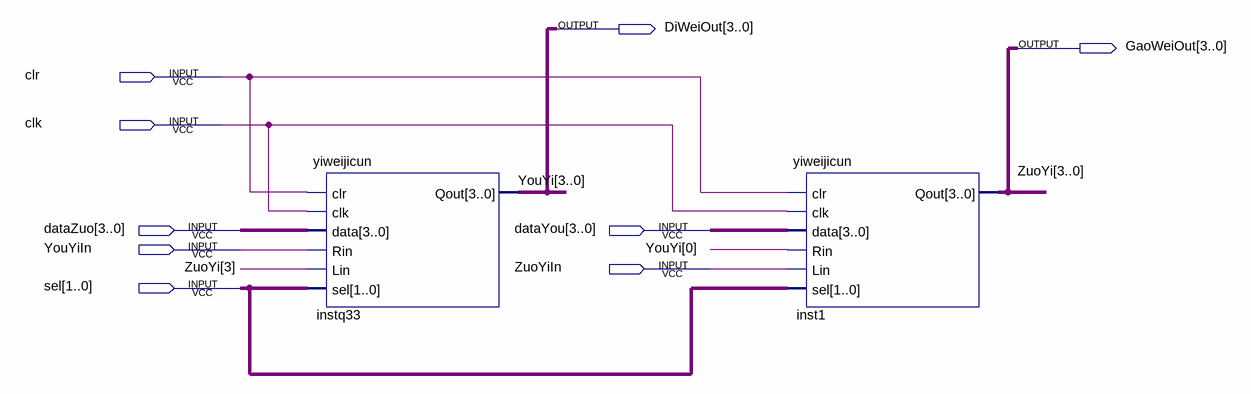
[diagram p0: schematic sheet]
// Quartus schematic g04_190711_08.bdf as structural Verilog: 2 symbols, 9 pins
module g04_190711_08 (
  input  clr,
  input  clk,
  input  [3:0] dataZuo,
  input  [3:0] dataYou,
  input  YouYiIn,
  input  ZuoYiIn,
  input  [1:0] sel,
  output [3:0] DiWeiOut,
  output [3:0] GaoWeiOut
);

  yiweijicun instq33 (
    .clr(clr), .clk(clk), .data(dataZuo), .Rin(YouYiIn), .Lin(GaoWeiOut[3]), .sel(sel), .Qout(DiWeiOut));
  yiweijicun inst1 (
    .clr(clr), .clk(clk), .data(dataYou), .Rin(DiWeiOut[0]), .Lin(ZuoYiIn), .sel(sel), .Qout(GaoWeiOut));

  // Other names for the same wires on the sheet: YouYi[3:0] = DiWeiOut; ZuoYi[3:0] = GaoWeiOut
endmodule
